# Altium schematic sheet Cool White LEDs.SchDoc: Cool White
size A4; SheetNumber: 3; SheetTotal: 4
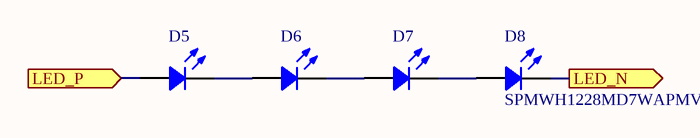
[diagram p0: Cool White LEDs.SchDoc]

## Parts
D5  SPMWH1228MD7WAPMVL  [SAMSUNG LM281BPLUS]  (value not drawn)
D6  SPMWH1228MD7WAPMVL  [SAMSUNG LM281BPLUS]  (value not drawn)
D7  SPMWH1228MD7WAPMVL  [SAMSUNG LM281BPLUS]  (value not drawn)
D8  SPMWH1228MD7WAPMVL  [SAMSUNG LM281BPLUS]

## Ports
LED_N (out), LED_P (in)

## Nets
LED_N: D8.C ; port LED_N
LED_P: D5.A ; port LED_P
NetD5_C: D5.C D6.A
NetD6_C: D6.C D7.A
NetD7_C: D7.C D8.A

## Notes on the sheet
- Title
- Size:
- Date:
- A4
- Number:
- Time:
- Revision:
- Sheet
- of
- File:

## Library data of the parts
D5-D8 = SPMWH1228MD7WAPMVL: LED; Manufacturer: Samsung Semiconductor, Inc.; CCT (K): 6500K; Color: White, Cool; CRI (Color Rendering Index): 90; Current - Max: 250mA; Current - Test: 65mA; Flux @ 25°C, Current - Test: 33lm (32lm ~ 34lm); Lumens/Watt @ Current - Test: 181 lm/W; Viewing Angle: 120°; Voltage - Forward (Vf) (Typ): 2.8V; Part Number: SPMWH1228MD7WAPMVL; ComponentLink1Description: Datasheet; ComponentLink1URL: https://media.digikey.com/pdf/Data%20Sheets/Samsung%20PDFs/LM281B_Plus%20Pro_VLrank_Rev_0.3_8-4-20.pdf; ComponentLink2Description: DigiKey Link; ComponentLink2URL: https://www.digikey.com/en/products/detail/samsung-semiconductor-inc/SPMWH1228MD7WAPMVL/13926354; Device Package: 1411 (3528 Metric); Height - Seated (Max): 0.031" (0.80mm); LastUpdated: 21/03/2022 19:15:16; Lifecycle Status: Active; Minimum Order: 1; Mounting Type: Surface Mount; Package / Case: 1411 (3528 Metric); Packaging: TapeAndReel; PartId: 129; Part Status: Active; Price: 0.05; Series: LM281B+; Size / Dimension: 0.138" L x 0.110" W (3.50mm x 2.80mm); Supplier 1: DigiKey; Supplier Part Number 1: 1510-SPMWH1228MD7WAPMVLCT-ND; Supplier Device Package: 1411